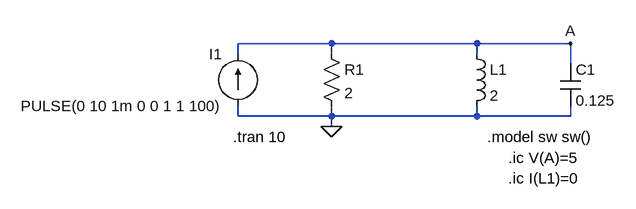
[diagram p0: schematic LTSPICE_CIRCUIT.asc]
LTSPICE_CIRCUIT.asc, the LTspice schematic file:
Version 4
SHEET 1 880 680
WIRE 64 96 -80 96
WIRE 288 96 64 96
WIRE 432 96 288 96
WIRE -80 112 -80 96
WIRE 64 112 64 96
WIRE 288 112 288 96
WIRE 432 128 432 96
WIRE -80 208 -80 192
WIRE 64 208 64 192
WIRE 64 208 -80 208
WIRE 288 208 288 192
WIRE 288 208 64 208
WIRE 432 208 432 192
WIRE 432 208 288 208
WIRE 64 224 64 208
FLAG 64 224 0
FLAG 432 96 A
SYMBOL res 48 96 R0
SYMATTR InstName R1
SYMATTR Value 2
SYMBOL ind 272 96 R0
SYMATTR InstName L1
SYMATTR Value 2
SYMBOL cap 416 128 R0
SYMATTR InstName C1
SYMATTR Value 0.125
SYMBOL current -80 192 R180
WINDOW 0 24 80 Left 2
WINDOW 3 24 0 Left 2
WINDOW 123 0 0 Left 0
WINDOW 39 0 0 Left 0
SYMATTR InstName I1
SYMATTR Value PULSE(0 10 1m 0 0 1 1 100)
TEXT -88 240 Left 2 !.tran 10
TEXT 304 240 Left 2 !.model sw sw()
TEXT 336 272 Left 2 !.ic V(A)=5
TEXT 336 304 Left 2 !.ic I(L1)=0

The netlist it stands for:
* LTSPICE_CIRCUIT.asc
R1 A 0 2
L1 A 0 2
C1 A 0 0.125
I1 0 A PULSE(0 10 1m 0 0 1 1 100)
.tran 10
.model sw sw()
.ic V(A)=5
.ic I(L1)=0
.backanno
.end